# Altium schematic sheet FE_channel.SchDoc: Front-End channel
size 420 x 297 mm; CheckedBy: K.Belewicz; DrawnBy: G.Kasprowicz; SheetNumber: 4; SheetTotal: 5; PageSetup: Record=PageOptions|CenterHorizontal=True|CenterVertical=True|PrintScale=0.97|XCorrection=1.00|YCorrection=1.00|PrintKind=1|BorderSize=5000000|LeftOffset=0|BottomOffset=0|Orientation=2|PaperLength=1000|PaperWidth=1000|Scale=100|PaperSource=7|PrintQuality=-4|MediaType=1|DitherType=10|PaperKind=A4 210 x 297mm|PrintScaleMode=1; ModifiedBy: -; CheckedDate: 12.06.2022; DivGrp: WUT ISE; Designer: G.Kasprowicz
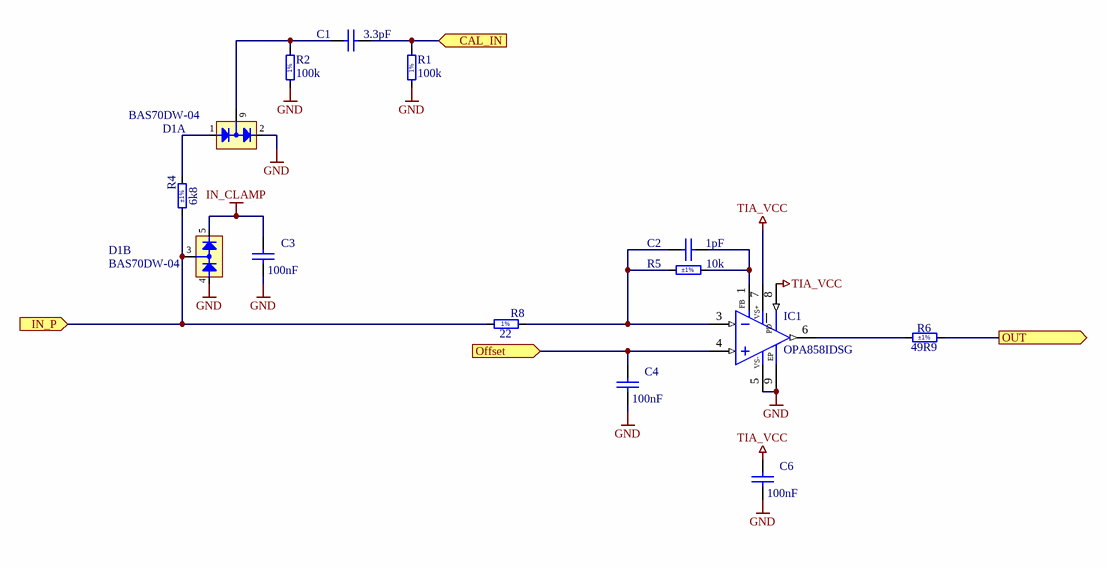
[diagram p0: FE_channel.SchDoc]

## Parts
C1  3.3pF  [CAPC1005X55N]
C2  1pF  [CAPC1005X55N]
C3  100nF  [CAPC0603X33N]
C4  100nF  [CAPC0603X33N]
C6  100nF  [CAPC0603X33N]
D1  BAS70DW-04  [SOT65P210X110-6N]  (parts A,B of 2)
IC1  OPA858IDSG  [TEXAS_DSG0008A]
R1  100k  [RESC1005X40N]
R2  100k  [RESC1005X40N]
R4  6k8  Tolerance: ±1%  [RESC1005X40N]
R5  10k  Tolerance: ±1%  [RESC1005X40N]
R6  49R9  Tolerance: ±1%  [RESC0603X28N]
R8  22  [RESC1005X40N]

## Ports
CAL_IN (in), IN_P (in), Offset (in), OUT (out)

## Nets
GND: C3.1 C4.1 C6.1 D1.2(C2) D1.4(A3) IC1.5(VS-) IC1.9(EP) R1.1 R2.1
IN_CLAMP: C3.2 D1.5(C4)
TIA_VCC: C6.2 IC1.7(VS+) IC1.8(/P/D)
CAL_IN: C1.2 R1.2 ; port CAL_IN
IN_P: D1.3(C3A4) R4.1 R8.1 ; port IN_P
Offset: C4.2 IC1.4(IN+) ; port Offset
OUT: R6.2 ; port OUT
NetC1_1: C1.1 D1.6(C1A2) R2.2
NetC2_1: C2.1 IC1.3(IN-) R5.1 R8.2
NetC2_2: C2.2 IC1.1(FB) R5.2
NetD1_1: D1.1(A) R4.2
NetIC1_6: IC1.6(OUT) R6.1

## Notes on the sheet
- Project/Equipment
- Document
- Designer
- Drawn by
- Check.by
- Copyright WUT ISE 2018.
  This documentation describes Open Hardware and is licensed under the CERN OHL v.1.1. You may redistribute and modify this documentation under the terms of the CERN OHL v.1.1. (http://ohwr.org/CERNOHL). This documentation is distributed WITHOUT ANY EXPRESS OR IMPLIED WARRANTY, INCLUDING OF MERCHANTABILITY, SATISFACTORY QUALITY AND FITNESS FOR A PARTICULAR PURPOSE. Please see the CERN OHL v.1.1 for applicable conditions.
- Contact
- File
- Last Mod.
- Print Date
- Sheet
- Size
- A3
- of
- Rev
- (in symbol OPA858IDSG) PD
- (in symbol R0402_22R_1%_0.0625W_100PPM) 1%
- (in symbol R0402_100K_1%_0.0625W_100PPM) 1%

## Library data of the parts
C1 = CC0402_3.3PF_50V_0.25PF_C0G: Non-polarised capacitor; Part Description: SMD Multilayer Chip Ceramic Capacitor; Manufacturer: GENERIC; Manufacturer1 Part Number: C0402C339C5GACTU; Voltage: 50V; TC: C0G/NP0; Tolerance: ±0.25pF; Part Number: CC0402_3.3PF_50V_0.25PF_C0G; Component Kind: Standard; Component Type: Standard; Pin Count: 2; Value: 3.3pF; Status: Preferred; Manufacturer Part Number: CC0402_3.3PF_50V_0.25PF_C0G; Case: 0402; Mounted: Yes; Socket: No; SMD: Yes; Sense: No; Manufacturer1 Example: KEMET; Manufacturer1 ComponentHeight: 0.55mm; HelpURL: \\cern.ch\dfs\Applications\Altium\Datasheets\CC0402_C0G_KEMET_(Commercial Grade).pdf; Author: CERN DEM JLC; CreateDate: 03.12.2007; LatestRevisionDate: 22.04.2015
C2 = CC0402_1PF_50V_0.25PF_C0G: Non-polarised capacitor; Part Description: SMD Multilayer Chip Ceramic Capacitor; Manufacturer: GENERIC; Manufacturer1 Part Number: C0402C109C5GACTU; Voltage: 50V; TC: C0G/NP0; Tolerance: ±0.25pF; Part Number: CC0402_1PF_50V_0.25PF_C0G; Component Kind: Standard; Component Type: Standard; Pin Count: 2; Value: 1pF; Status: Preferred; Manufacturer Part Number: CC0402_1PF_50V_0.25PF_C0G; Case: 0402; Mounted: Yes; Socket: No; SMD: Yes; Sense: No; Manufacturer1 Example: KEMET; Manufacturer1 ComponentHeight: 0.55mm; HelpURL: \\cern.ch\dfs\Applications\Altium\Datasheets\CC0402_C0G_KEMET_(Commercial Grade).pdf; Author: CERN DEM JLC; CreateDate: 03.12.2007; LatestRevisionDate: 22.04.2015
C3 C4 C6 = CC0201_100NF_6.3V_10%_X5R: Non-polarised capacitor; Part Description: SMD Multilayer Chip Ceramic Capacitor; Manufacturer: GENERIC; Manufacturer1 Part Number: 02016D104KAT2A; Voltage: 6.3V; TC: X5R; Tolerance: ±10%; Part Number: CC0201_100NF_6.3V_10%_X5R; Component Kind: Standard; Component Type: Standard; Pin Count: 2; Value: 100nF; Status: Not Recommended; Manufacturer Part Number: CC0201_100NF_6.3V_10%_X5R; Case: 0201; Mounted: Yes; Socket: No; SMD: Yes; Sense: No; Manufacturer1 Example: AVX; Manufacturer1 ComponentHeight: 0.33mm; HelpURL: \\cern.ch\dfs\Applications\Altium\Datasheets\CC0201_X5R_AVX.pdf; Author: CERN DEM JLC; CreateDate: 03.12.2007; LatestRevisionDate: 03.12.2007
D1 = D_BAS70DW-04: 70 V 70 mA Surface Mount Schottky Barrier Diode Arrays; Part Description: Integrated Dual Serial Pair High-Speed Switching Diodes; Manufacturer: Diodes; Voltage: 70V; Power: 70mA; PressFit: No; Bonding: No; Part Number: BAS70DW-04; Component Kind: Standard; Component Type: Standard; Device: BAS70DW-04; PackageDescription: SOT363, SC70-6, 0.65mm Pitch; 6 pin, 1.25mm W X 2.00mm L X 1.10mm H body, IPC Medium Density; Manufacturer Part Number: BAS70DW-04; Pin Count: 6; Case: SOT363; Mounted: Yes; Socket: No; SMD: Yes; Sense: No; ComponentHeight: 1.1mm; HelpURL: \\cern.ch\dfs\Applications\Altium\Datasheets\BAV99S.pdf; Author: GK; CreateDate: 15.01.2018; LatestRevisionDate: 15.01.2018
IC1 = OPA858IDSG: 5.5-GHz Gain Bandwidth Product, Gain of 7 V/V Stable, FET Input Amplifier; Manufacturer: TEXAS INSTRUMENTS; PressFit: No; Bonding: No; Part Number: OPA858IDSG; Component Kind: Standard; Component Type: Standard; Device: OPA858IDSG; PackageDescription: TEXAS Case Style DSG (WSON-N8), SON, 0.50mm Pitch, 8 Pin, 2.00mm X 2.00mm X 0.80mm H body (w/Thermal Tab 1.00 X 1.70mm); Part Description: 5.5-GHz Gain Bandwidth Product, Gain of 7 V/V Stable, FET Input Amplifier; Manufacturer Part Number: OPA858IDSG; Pin Count: 8; Case: SON8; Mounted: Yes; Socket: No; SMD: Yes; Sense: No; ComponentHeight: 0.8mm; Author: CERN DEM HF; HelpURL: \\cern.ch\dfs\Applications\Altium\Datasheets\OPA858IDSG.pdf; CreateDate: 19.04.2022; LatestRevisionDate: 19.04.2022
R1 R2 = R0402_100K_1%_0.0625W_100PPM: Resistor - 1%; Part Description: General Purpose Thick Film Chip Resistor; Manufacturer: GENERIC; Manufacturer1 Part Number: 232270671004L; TC: ±100ppm/°C; Table: Resistors SMD; Part Number: R0402_100K_1%_0.0625W_100PPM; Component Kind: Standard; Component Type: Standard; Pin Count: 2; Value: 100k; Status: Not recommended; Power: 0.0625W; Tolerance: ±1%; Manufacturer Part Number: R0402_100K_1%_0.0625W_100PPM; Case: 0402; Mounted: Yes; Socket: No; SMD: Yes; Manufacturer1 Example: YAGEO PHYCOMP; Manufacturer1 ComponentHeight: 0.4mm; HelpURL: \\cern.ch\dfs\Applications\Altium\Datasheets\R0402_Phycomp_RC0402.pdf; Author: CERN DEM JLC; CreateDate: 2007-12-03; LatestRevisionDate: 2012-10-17
R4 = R0402_6K8_1%_0.0625W_100PPM: Resistor - 1%; Part Description: General Purpose Thick Film Chip Resistor; Manufacturer: GENERIC; Manufacturer1 Part Number: 232270676802L; TC: ±100ppm/°C; PressFit: No; Part Number: R0402_6K8_1%_0.0625W_100PPM; Component Kind: Standard; Component Type: Standard; Pin Count: 2; Value: 6k8; Status: Not Recommended; Power: 0.0625W; Manufacturer Part Number: R0402_6K8_1%_0.0625W_100PPM; Case: 0402; Mounted: Yes; Sense: No; Socket: No; SMD: Yes; Manufacturer1 Example: YAGEO PHYCOMP; Manufacturer1 ComponentHeight: 0.4mm; HelpURL: \\cern.ch\dfs\Applications\Altium\Datasheets\R0402_Phycomp_RC0402.pdf; Author: CERN DEM JLC; CreateDate: 03.12.2007; LatestRevisionDate: 17.10.2012
R5 = R0402_10K_1%_0.0625W_100PPM: Resistor - 1%; Part Description: General Purpose Thick Film Chip Resistor; Manufacturer: GENERIC; Manufacturer1 Part Number: 232270671003L; TC: ±100ppm/°C; PressFit: No; Part Number: R0402_10K_1%_0.0625W_100PPM; Component Kind: Standard; Component Type: Standard; Pin Count: 2; Value: 10k; Status: Not Recommended; Power: 0.0625W; Manufacturer Part Number: R0402_10K_1%_0.0625W_100PPM; Case: 0402; Mounted: Yes; Sense: No; Socket: No; SMD: Yes; Manufacturer1 Example: YAGEO PHYCOMP; Manufacturer1 ComponentHeight: 0.4mm; HelpURL: \\cern.ch\dfs\Applications\Altium\Datasheets\R0402_Phycomp_RC0402.pdf; Author: CERN DEM JLC; CreateDate: 03.12.2007; LatestRevisionDate: 17.10.2012
R6 = R0201_49R9_1%_0.05W_200PPM: Resistor - 1%; Part Description: Thick Film Chip Resistor; Manufacturer: GENERIC; Manufacturer1 Part Number: CRCW020149R9FNED; Power: 0.05W; TC: ±200ppm/°C; PressFit: No; Part Number: R0201_49R9_1%_0.05W_200PPM; Component Kind: Standard; Component Type: Standard; Pin Count: 2; Value: 49R9; Status: Not Recommended; Manufacturer Part Number: R0201_49R9_1%_0.05W_200PPM; Case: 0201; Mounted: Yes; Sense: No; Socket: No; SMD: Yes; Manufacturer1 Example: VISHAY; Manufacturer1 ComponentHeight: 0.27mm; HelpURL: \\cern.ch\dfs\Applications\Altium\Datasheets\R0201_VISHAY_CRCW e3.pdf; Author: CERN DEM BC; CreateDate: 10.01.2020; LatestRevisionDate: 10.01.2020
R8 = R0402_22R_1%_0.0625W_100PPM: Resistor - 1%; Part Description: General Purpose Thick Film Chip Resistor; Manufacturer: GENERIC; Manufacturer1 Part Number: 232270672209L; TC: ±100ppm/°C; Table: Resistors SMD; Part Number: R0402_22R_1%_0.0625W_100PPM; Component Kind: Standard; Component Type: Standard; Pin Count: 2; Value: 22; Status: Not recommended; Power: 0.0625W; Tolerance: ±1%; Manufacturer Part Number: R0402_22R_1%_0.0625W_100PPM; Case: 0402; Mounted: Yes; Socket: No; SMD: Yes; Manufacturer1 Example: YAGEO PHYCOMP; Manufacturer1 ComponentHeight: 0.4mm; HelpURL: \\cern.ch\dfs\Applications\Altium\Datasheets\R0402_Phycomp_RC0402.pdf; Author: CERN DEM JLC; CreateDate: 2007-12-03; LatestRevisionDate: 2012-10-17